# EAGLE design ECE411_T10_schematic (EAGLE 7.1.0)
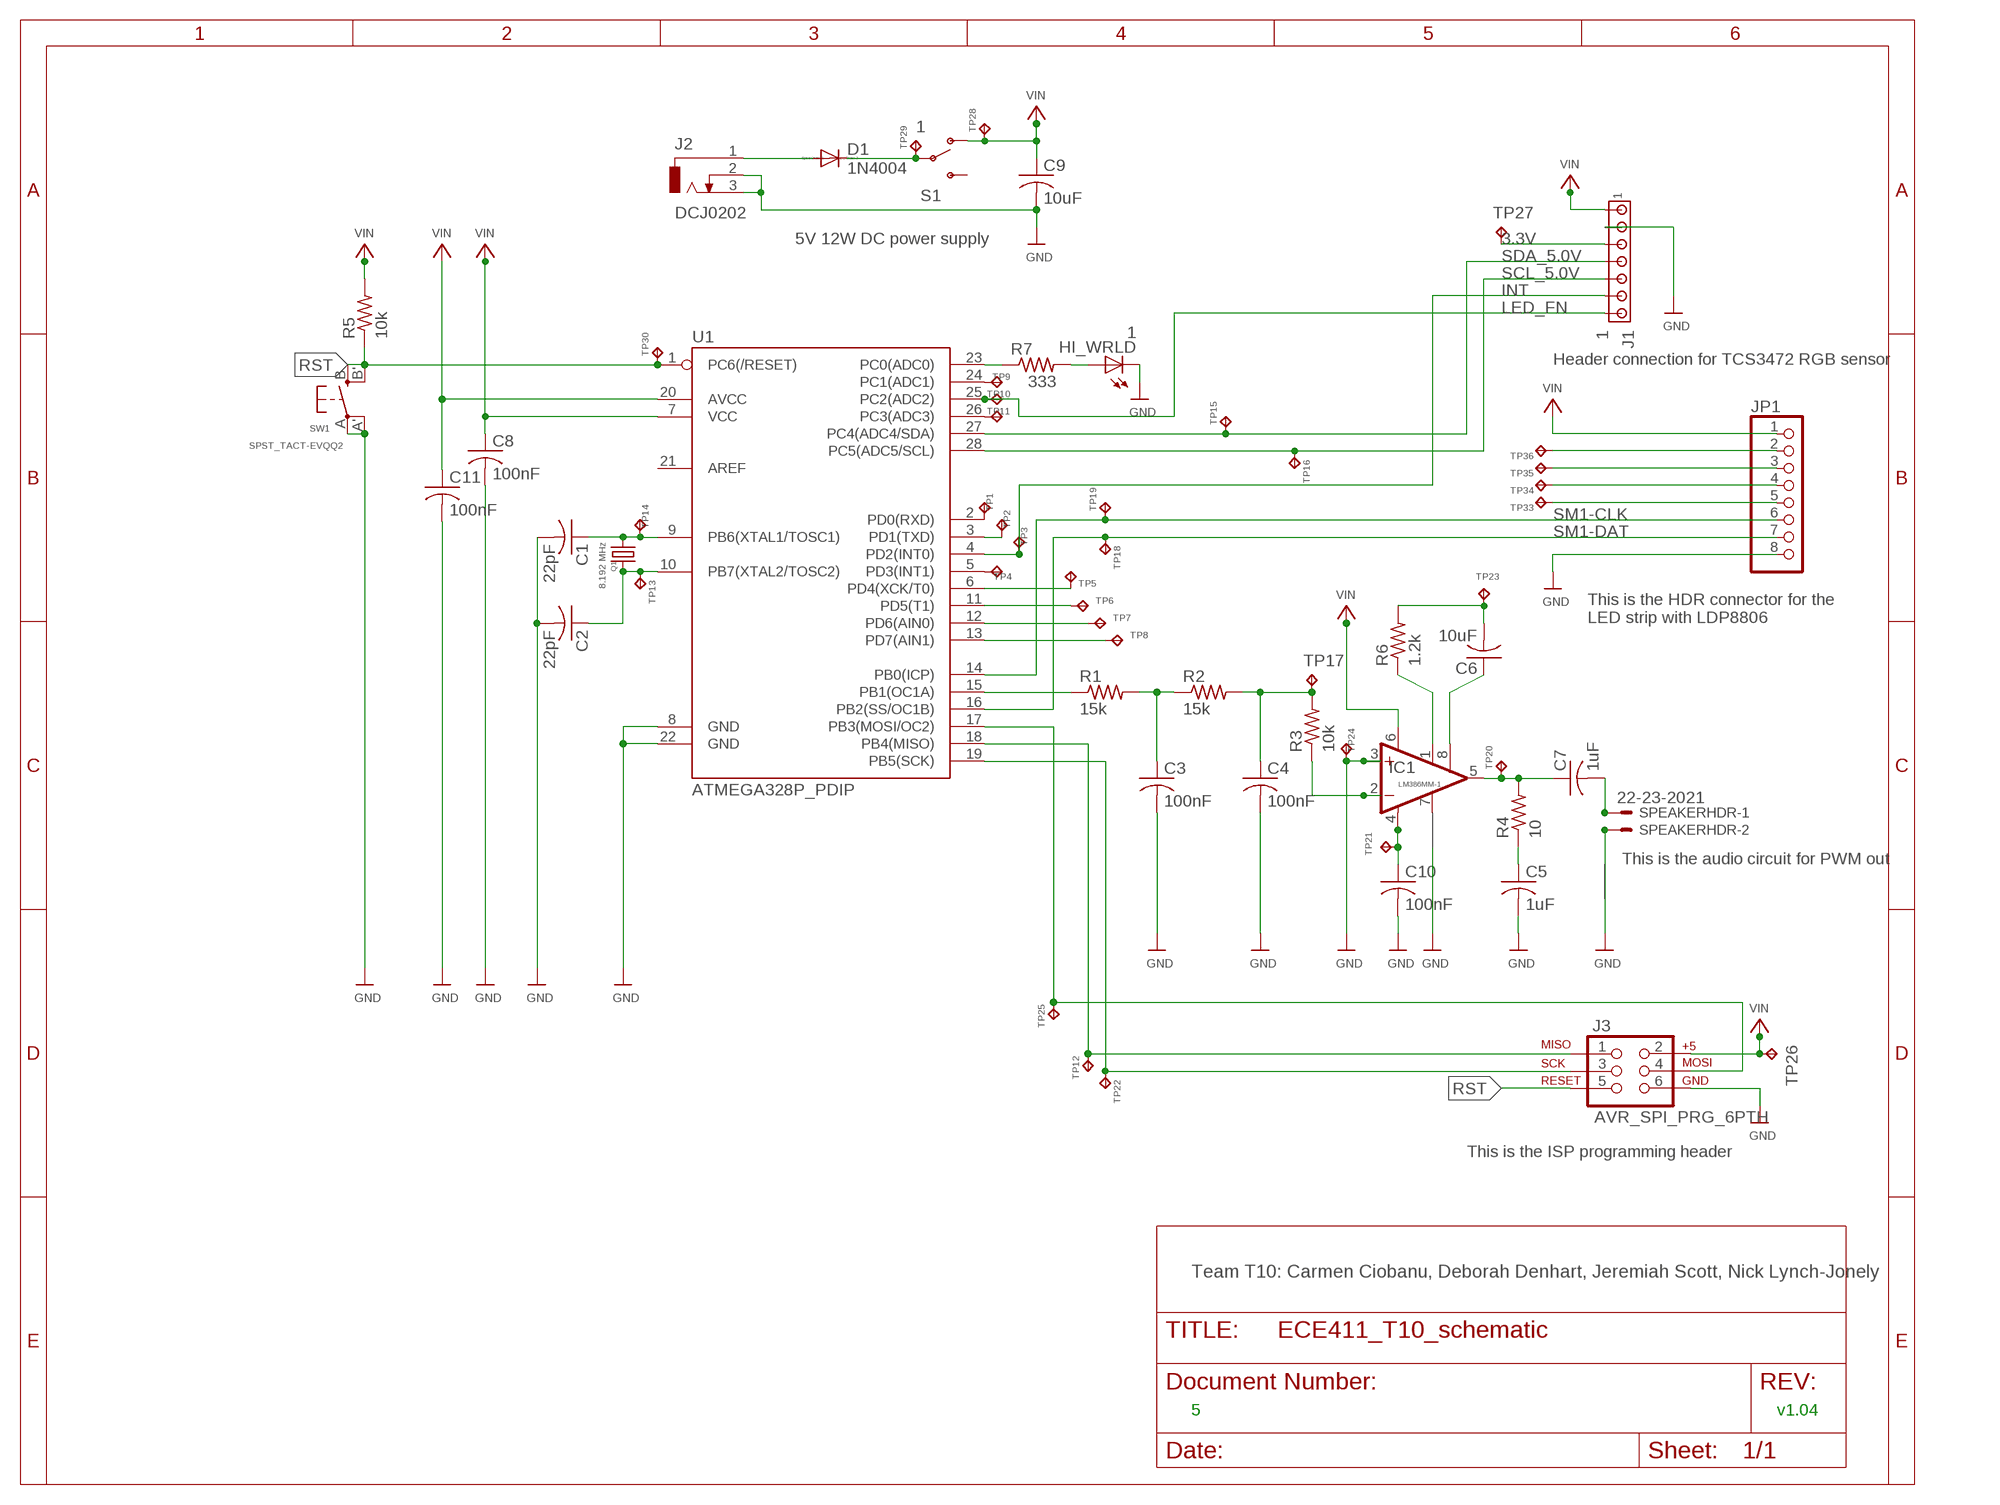
[diagram p0: schematic, sheet 1]

## Parts
C1  22pF  C-USC0805  [C0805]
C2  22pF  C-USC0805  [C0805]
C3  100nF  C-USC0805  [C0805]
C4  100nF  C-USC0805  [C0805]
C5  1uF  C-USC0805  [C0805]
C6  10uF  C-USC0805  [C0805]
C7  1uF  C-USC0805  [C0805]
C8  100nF  C-USC0805  [C0805]
C9  10uF  C-USC0805  [C0805]
C10  100nF  C-USC0805  [C0805]
C11  100nF  C-USC0805  [C0805]
D1  1N4004  [DO41-10]
HI_WRLD  1  LEDSML1206  [SML1206]
IC1  LM386MM-1  [MMSOP08]
J1  1  MTA07-100  [10X07MTA]
J2  DCJ0202  [DCJ0202]
J3  AVR_SPI_PRG_6PTH  [2X3]
JP1  PINHD-1X8  [1X08]
Q1  8.192 MHz  CRYSTALHC49S  [HC49/S]
R1  15k  R-US_M0805  [M0805]
R2  15k  R-US_M0805  [M0805]
R3  10k  R-US_M0805  [M0805]
R4  10  R-US_M0805  [M0805]
R5  10k  R-US_M0805  [M0805]
R6  1.2k  R-US_M0805  [M0805]
R7  333  R-US_M0805  [M0805]
S1  1  SWITCH-SPDT-SMD-A  [SWITCH-SPST-SMD-A]
SPEAKERHDR  22-23-2021  [22-23-2021]
SW1  SPST_TACT-EVQQ2  [EVQ-Q2]
TP1  TPB1,27  [B1,27]
TP2  TPB1,27  [B1,27]
TP3  TPB1,27  [B1,27]
TP4  TPB1,27  [B1,27]
TP5  TPB1,27  [B1,27]
TP6  TPB1,27  [B1,27]
TP7  TPB1,27  [B1,27]
TP8  TPB1,27  [B1,27]
TP9  TPB1,27  [B1,27]
TP10  TPB1,27  [B1,27]
TP11  TPB1,27  [B1,27]
TP12  TPB1,27  [B1,27]
TP13  TPB1,27  [B1,27]
TP14  TPB1,27  [B1,27]
TP15  TPB1,27  [B1,27]
TP16  TPB1,27  [B1,27]
TP17  TPB1,27  [B1,27]
TP18  TPB1,27  [B1,27]
TP19  TPB1,27  [B1,27]
TP20  TPB1,27  [B1,27]
TP21  TPB1,27  [B1,27]
TP22  TPB1,27  [B1,27]
TP23  TPB1,27  [B1,27]
TP24  TPB1,27  [B1,27]
TP25  TPB1,27  [B1,27]
TP26  TPB1,27  [B1,27]
TP27  TPB1,27  [B1,27]
TP28  TPB1,27  [B1,27]
TP29  TPB1,27  [B1,27]
TP30  TPB1,27  [B1,27]
TP33  TPB1,27  [B1,27]
TP34  TPB1,27  [B1,27]
TP35  TPB1,27  [B1,27]
TP36  TPB1,27  [B1,27]
U1  ATMEGA328P_PDIP  [DIL28-3]

## Nets
3.3V: J1.3 TP27.TP
GND: C1.2 C2.2 C3.2 C4.2 C5.2 C8.2 C9.2 C10.2 C11.2 HI_WRLD.C IC1.3(+IN) IC1.7(BYPASS) J1.2 J2.2 J2.3 J3.6 JP1.8 SPEAKERHDR.2 SW1.A'(P1) SW1.A(P) TP24.TP U1.8(GND) U1.22(GND)
INT: J1.6 TP3.TP U1.4(PD2(INT0))
LED_FN: J1.7 TP10.TP U1.25(PC2(ADC2))
N$1: C2.1 Q1.1 TP13.TP U1.10(PB7(XTAL2/TOSC2))
N$2: C1.1 Q1.2 TP14.TP U1.9(PB6(XTAL1/TOSC1))
N$3: IC1.1(GAIN) R6.1
N$4: R1.1 U1.15(PB1(OC1A))
N$5: C3.1 R1.2 R2.1
N$6: C4.1 R2.2 R3.2 TP17.TP
N$7: C6.1 IC1.8(GAIN)
N$8: IC1.2(-IN) R3.1
N$9: C5.1 R4.1
N$10: R7.1 U1.23(PC0(ADC0))
N$11: C6.2 R6.2 TP23.TP
N$12: C7.1 IC1.5(OUT) R4.2 TP20.TP
N$13: D1.A J2.1
N$14: C7.2 SPEAKERHDR.1
N$15: D1.C S1.2(P) TP29.TP
N$16: TP1.TP U1.2(PD0(RXD))
N$17: HI_WRLD.A R7.2
N$18: J3.3 TP22.TP U1.19(PB5(SCK))
N$19: J3.1 TP12.TP U1.18(PB4(MISO))
N$20: J3.4 TP25.TP U1.17(PB3(MOSI/OC2))
N$21: TP5.TP U1.6(PD4(XCK/T0))
N$22: TP2.TP U1.3(PD1(TXD))
N$24: TP4.TP U1.5(PD3(INT1))
N$25: TP6.TP U1.11(PD5(T1))
N$26: TP7.TP U1.12(PD6(AIN0))
N$27: TP8.TP U1.13(PD7(AIN1))
N$28: TP9.TP U1.24(PC1(ADC1))
N$30: TP11.TP U1.26(PC3(ADC3))
N$31: C10.1 IC1.4(GND) TP21.TP
N$33: JP1.2 TP36.TP
N$34: JP1.3 TP35.TP
N$35: JP1.4 TP34.TP
N$36: JP1.5 TP33.TP
RST: J3.5 R5.1 SW1.B'(S1) SW1.B(S) TP30.TP U1.1(PC6(/RESET))
SCL_5.0V: J1.5 TP16.TP U1.28(PC5(ADC5/SCL))
SDA_5.0V: J1.4 TP15.TP U1.27(PC4(ADC4/SDA))
SM1-CLK: JP1.6 TP19.TP U1.14(PB0(ICP))
SM1-DAT: JP1.7 TP18.TP U1.16(PB2(SS/OC1B))
VIN: C8.1 C9.1 C11.1 IC1.6(VS) J1.1 J3.2 JP1.1 R5.2 S1.1(O) TP26.TP TP28.TP U1.7(VCC) U1.20(AVCC)
Unconnected: S1.3(S) U1.21(AREF)

## Notes on the sheet
- 5V 12W DC power supply
- Header connection for TCS3472 RGB sensor
- This is the HDR connector for the 
  LED strip with LDP8806
- This is the audio circuit for PWM out
- This is the ISP programming header
- Team T10: Carmen Ciobanu, Deborah Denhart, Jeremiah Scott, Nick Lynch-Jonely
- 5 | v1.04

## Library data of the parts
C1-C10 = resistor:C-US: CAPACITOR, American symbol
C11 = adafruit:C-US: CAPACITOR, American symbol
D1 = diode:1N4004: DIODE general purpose rectifier, 1 A
HI_WRLD = led:LED: LED OSRAM: - CHIPLED LG R971, LG N971, LY N971, LG Q971, LY Q971, LO R971, LY R971 LH N974, LH R974 LS Q976, LO Q976, LY Q976 LO Q996 - Hyper CHIPLED LW Q18S LB Q993, LB Q99A, LB R99A - SideLED LS A670, LO A670, LY A670, LG A670, LP A670 LB A673, LV A673, LT A673, LW A673 LH A674 LY A675 LS A676, LA A676, LO A676, LY A676, LW A676 LS A679, LY A679, LG A679 - Hyper Micro SIDELED® LS Y876, LA Y876, LO Y876, LY Y876 LT Y87S - SmartLED LW L88C, LW L88S LB L89C, LB L89S, LG L890 LS L89K, LO L89K, LY L89K LS L896, LA L896, LO L896, LY L896 - TOPLED LS T670, LO T670, LY T670, LG T670, LP T670 LSG T670, LSP T670, LSY T670, LOP T670, LYG T670 LG T671, LOG T671, LSG T671 LB T673, LV T673, LT T673, LW T673 LH T674 LS T676, LA T676, LO T676, LY T676, LB T676, LH T676, LSB T676, LW T676 LB T67C, LV T67C, LT T67C, LS T67K, LO T67K, LY T67K, LW E67C LS E67B, LA E67B, LO E67B, LY E67B, LB E67C, LV E67C, LT E67C LW T67C LS T679, LY T679, LG T679 LS T770, LO T770, LY T770, LG T770, LP T770 LB T773, LV T773, LT T773, LW T773 LH T774 LS E675, LA E675, LY E675, LS T675 LS T776, LA T776, LO T776, LY T776, LB T776 LHGB T686 LT T68C, LB T68C - Hyper Mini TOPLED® LB M676 - Mini TOPLED Santana® LG M470 LS M47K, LO M47K, LY M47K Source: http://www.osram.convergy.de LUXEON: - LUMILED® LXK2-PW12-R00, LXK2-PW12-S00, LXK2-PW14-U00, LXK2-PW14-V00 LXK2-PM12-R00, LXK2-PM12-S00, LXK2-PM14-U00 LXK2-PE12-Q00, LXK2-PE12-R00, LXK2-PE12-S00, LXK2-PE14-T00, LXK2-PE14-U00 LXK2-PB12-K00, LXK2-PB12-L00, LXK2-PB12-M00, LXK2-PB14-N00, LXK2-PB14-P00, LXK2-PB14-Q00 LXK2-PR12-L00, LXK2-PR12-M00, LXK2-PR14-Q00, LXK2-PR14-R00 LXK2-PD12-Q00, LXK2-PD12-R00, LXK2-PD12-S00 LXK2-PH12-R00, LXK2-PH12-S00 LXK2-PL12-P00, LXK2-PL12-Q00, LXK2-PL12-R00 Source: www.luxeon.com KINGBRIGHT: KA-3528ASYC Source: www.kingbright.com
IC1 = linear:LM386?-*: Low Voltage Audio Power Amplifier Source: http://cache.national.com/ds/LM/LM386.pdf
J1 = con-amp:MTA07-100: AMP connector
J2 = con-jack:DCJ0202: DC POWER JACK Source: DCJ0202.pdf; OC_FARNELL: unknown; OC_NEWARK: unknown
J3 = SparkFun-Connectors:AVR_SPI_PRG_6: AVR ISP 6 Pin This is the reduced ISP connector for AVR programming. Common on Arduino. This footprint will take up less PCB space and can be used with a 10-pin to 6-pin adapter such as SKU: BOB-08508 **Special note about "TEST_POINT" package. The stop mask is on the top side, so if you want your programming test points to be on the bottom of your board, make sure to place this package on the bottom side of the board. This also ensure that the orientation to program from the bottom side will be correct.
JP1 = pinhead:PINHD-1X8: PIN HEADER
Q1 = adafruit:CRYSTAL: CRYSTAL; OC_FARNELL: 1667008; OC_NEWARK: unknown
R1-R7 = resistor:R-US_: RESISTOR, American symbol
S1 = SparkFun-Electromechanical:SWITCH-SPDT: SPDT Switch Simple slide switch, Spark Fun Electronics SKU : COM-00102 DPDT SMT slide switch, AYZ0202, SWCH-08179
SPEAKERHDR = con-molex:22-23-2021: .100" (2.54mm) Center Header - 2 Pin; MF: MOLEX; MPN: 22-23-2021; OC_FARNELL: 1462926; OC_NEWARK: 25C3832
SW1 = adafruit:SPST_TACT: SMT 6mm switch, EVQQ2 series http://www.ladyada.net/library/eagle
TP1-TP30 TP33-TP36 = testpad:TP: Test pad
U1 = SparkFun-DigitalIC:ATMEGA328P_PDIP: uC used in the Arduino 32kb flash, 1k EEPROM, 2k SRAM This is the through-hole version of this chip.

## Board
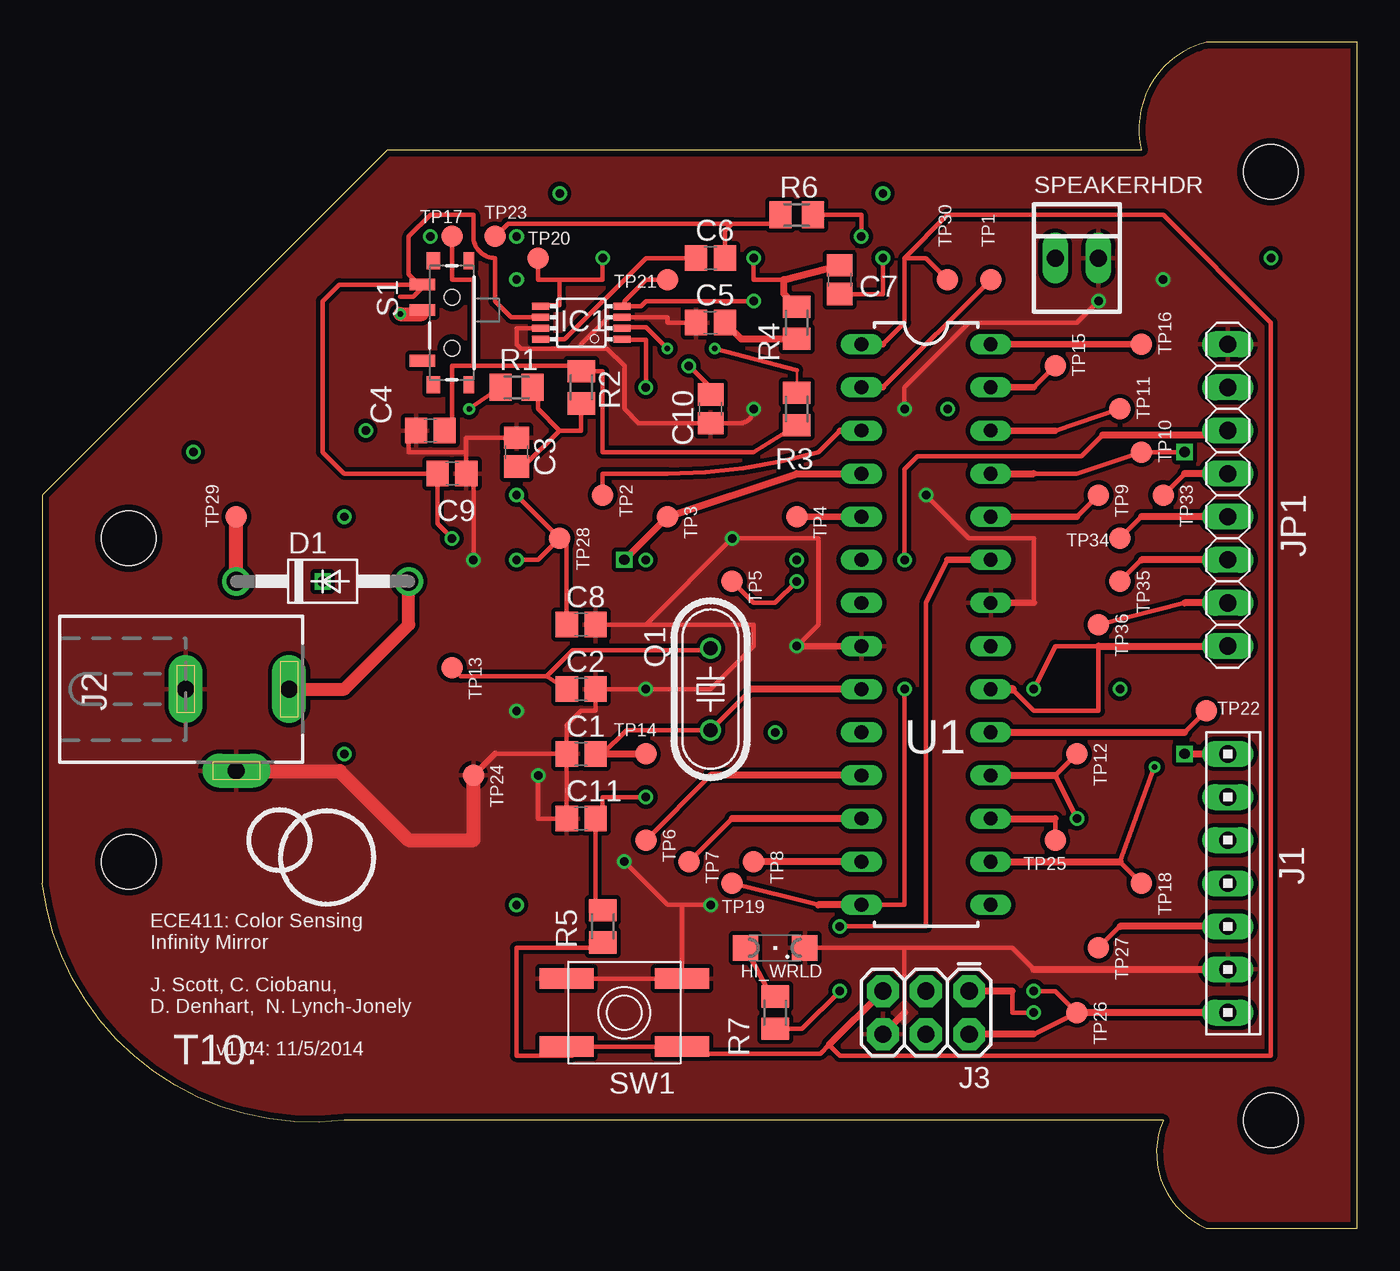
[diagram p1: board, top side]
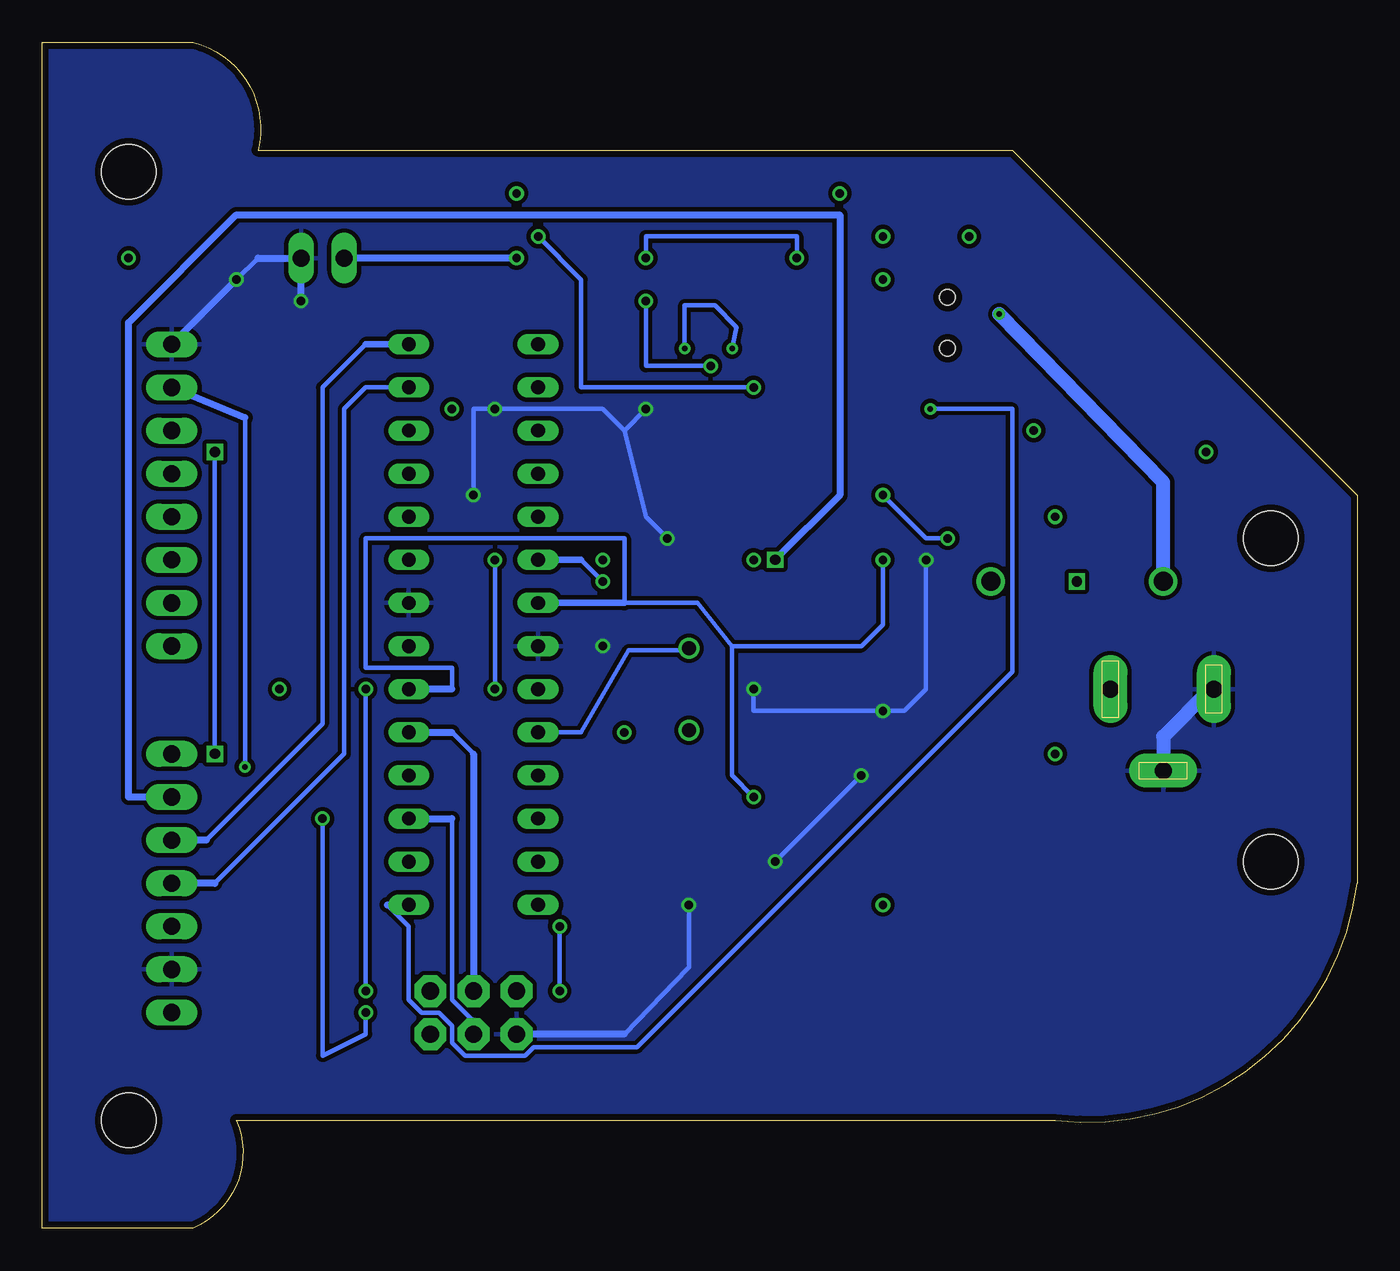
[diagram p2: board, bottom side, seen from below]

Size 77.47 x 69.85 mm. Coordinates in mm from the lower left corner, seen from the top.
Outline: 77.47,0 77.47,69.85 68.58,69.85 arc90 64.77,63.5 20.32,63.5 0,43.18 0,20.32 arc90 17.78,6.35 66.04,6.35 arc90 68.58,0 77.47,0
Copper layers (1*16): Top 0.0356mm / dielectric 1.5011mm / Bottom 0.0356mm
Design rules "OSH-Park-2-layer": minimum track width 6mil, minimum drill 13mil, track to track 6mil, track to pad 6mil, pad to pad 6mil, via to via 6mil, smd to smd 6mil, copper to edge 15mil, drill to drill 6mil, minimum pad ring 7mil, minimum via ring 7mil, stop-mask expansion 3mil, vias tented up to drill 0mil, thermal gap 10mil
Holes 3.2 mm at 72.39,62.23 72.39,6.35 5.08,40.64 5.08,21.59

### Footprints (pad centres in the part's own frame; a part is rotated, then mirrored left to right if it is on the bottom)
C0805 = smd 1.3 x 1.5: 1 -0.85,0; 2 0.85,0
DO41-10 = drill 1.118: A 5.08,0; C -5.08,0
SML1206 = smd 1.5 x 1.5: A 1.75,0; C -1.75,0
MMSOP08 = smd 0.41 x 1.02: 1 -0.975,-2.4; 2 -0.325,-2.4; 3 0.325,-2.4; 4 0.975,-2.4; 5 0.975,2.4; 6 0.325,2.4; 7 -0.325,2.4; 8 -0.975,2.4
10X07MTA = drill 1.016 long: 1 7.62,0; 2 5.08,0; 3 2.54,0; 4 0,0; 5 -2.54,0; 6 -5.08,0; 7 -7.62,0
DCJ0202 = drill 1 pad 2 long: 1 0,3.1; 2 4.8,0; 3 0,-3
2X3 = drill 1.016 pad 1.88 octagon: 1 0,0; 2 0,2.54; 3 2.54,0; 4 2.54,2.54; 5 5.08,0; 6 5.08,2.54
1X08 = drill 1.016 long: 1 -8.89,0; 2 -6.35,0; 3 -3.81,0; 4 -1.27,0; 5 1.27,0; 6 3.81,0; 7 6.35,0; 8 8.89,0
HC49/S = drill 0.813: 1 -2.413,0; 2 2.413,0
M0805 = smd 1.3 x 1.6: 1 -0.95,0; 2 0.95,0
SWITCH-SPST-SMD-A = smd 0.7 x 1.5: 1 -2.25,-1.75; 2 -0.75,-1.75; 3 2.25,-1.75 | smd 1 x 0.6: GND1 -3.65,1; GND3 3.65,1 | smd 1 x 0.8: GND2 -3.65,-1.1; GND4 3.65,-1.1 | hole 0.9: -1.5,0; 1.5,0
22-23-2021 = drill 1 long: 1 -1.27,0; 2 1.27,0
EVQ-Q2 = smd 3.2 x 1.2: A -3.4,-2; A' 3.4,-2; B -3.4,2; B' 3.4,2
B1,27 = smd 1.27 x 1.27: TP 0,0
DIL28-3 = drill 0.813 long: 1 -16.51,-3.81; 2 -13.97,-3.81; 3 -11.43,-3.81; 4 -8.89,-3.81; 5 -6.35,-3.81; 6 -3.81,-3.81; 7 -1.27,-3.81; 8 1.27,-3.81; 9 3.81,-3.81; 10 6.35,-3.81; 11 8.89,-3.81; 12 11.43,-3.81; 13 13.97,-3.81; 14 16.51,-3.81; 15 16.51,3.81; 16 13.97,3.81; 17 11.43,3.81; 18 8.89,3.81; 19 6.35,3.81; 20 3.81,3.81; 21 1.27,3.81; 22 -1.27,3.81; 23 -3.81,3.81; 24 -6.35,3.81; 25 -8.89,3.81; 26 -11.43,3.81; 27 -13.97,3.81; 28 -16.51,3.81

### Placement (x,y rotation side)
C1  31.75,27.94 180 top
C2  31.75,31.75 0 top
C3  27.94,45.72 90 top
C4  22.86,46.99 180 top
C5  39.37,53.34 180 top
C6  39.37,57.15 0 top
C7  46.99,55.88 270 top
C8  31.75,35.56 0 top
C9  24.13,44.45 0 top
C10  39.37,48.26 270 top
C11  31.75,24.13 180 top
D1  16.51,38.1 0 top
HI_WRLD  43.18,16.51 180 top
IC1  31.75,53.34 90 top
J1  69.85,20.32 270 top
J2  11.43,31.75 270 top
J3  54.61,13.97 180 top
JP1  69.85,43.18 90 top
Q1  39.37,31.75 270 top
R1  27.94,49.53 0 top
R2  31.75,49.53 90 top
R3  44.45,48.26 270 top
R4  44.45,53.34 90 top
R5  33.02,17.78 90 top
R6  44.45,59.69 180 top
R7  43.18,12.7 90 top
S1  24.13,53.34 270 top
SPEAKERHDR  60.96,57.15 0 top
SW1  34.29,12.7 180 top
TP1  55.88,55.88 0 top
TP2  33.02,43.18 0 top
TP3  36.83,41.91 0 top
TP4  44.45,41.91 0 top
TP5  40.64,38.1 0 top
TP6  35.56,22.86 0 top
TP7  38.1,21.59 0 top
TP8  41.91,21.59 0 top
TP9  62.23,43.18 0 top
TP10  64.77,45.72 0 top
TP11  63.5,48.26 0 top
TP12  60.96,27.94 0 top
TP13  24.13,33.02 0 top
TP14  35.56,27.94 0 top
TP15  59.69,50.8 0 top
TP16  64.77,52.07 0 top
TP17  24.13,58.42 0 top
TP18  64.77,20.32 0 top
TP19  40.64,20.32 0 top
TP20  29.21,57.15 0 top
TP21  36.83,55.88 0 top
TP22  68.58,30.48 0 top
TP23  26.67,58.42 0 top
TP24  25.4,26.67 0 top
TP25  59.69,22.86 0 top
TP26  60.96,12.7 0 top
TP27  62.23,16.51 0 top
TP28  30.48,40.64 0 top
TP29  11.43,41.91 0 top
TP30  53.34,55.88 0 top
TP33  66.04,43.18 0 top
TP34  63.5,40.64 0 top
TP35  63.5,38.1 0 top
TP36  62.23,35.56 0 top
U1  52.07,35.56 270 top

### Tracks (layer width: path | path; a pad name or v marks a point on that pad's centre or on a via)
3.3V
  Top 0.254: 63.5,17.78 TP27.TP
  Top 0.406: J1.3 63.5,17.78
GND  (via drill 0.5)
  Top 0.152: 11.43,26.92 J2.2 | 25.65,26.92 TP24.TP | 34.04,53.59 IC1.3
  Top 0.254: C1.2 26.67,27.94 | 31.75,51.82 33.27,51.82 34.29,50.8 34.29,48.26 35.14,47.41 C10.2 41.06,47.41 arc90 v41.91,48.26 | 31.75,51.82 28.19,51.82 27.94,52.07 27.94,53.02 IC1.7 | 50.8,12.7 50.8,16.51 | 50.8,16.51 57.15,16.51 58.42,15.24 | HI_WRLD.C 50.8,16.51 | SW1.A' SW1.A 37.69,19.05 | 58.42,36.83 58.42,40.64 54.61,40.64 v52.07,43.18 | v44.45,34.29 45.72,35.56 45.72,40.64 v40.64,40.64 35.56,35.56 | 37.69,19.05 v39.37,19.05 | 31.75,51.82 31.75,52.07 33.34,53.67 IC1.3 36.83,53.67 36.83,53.34 C5.2 | C1.2 C11.2 29.21,24.13 v29.21,26.67 | C1.2 30.9,29.63 31.75,30.48 32.6,30.48 C2.2 v35.56,31.75 39.37,31.75 41.91,34.29 41.91,35.56 35.56,35.56 | C8.2 35.56,35.56 | 24.98,45.72 C9.2 25.4,44.45 v25.4,39.37 | 24.98,45.72 24.98,46.57 C3.2 | 24.98,45.72 21.59,45.72 21.59,46.99 C4.2 | 37.69,19.05 36.83,19.05 v34.29,21.59 | v50.8,48.26 50.8,49.53 54.61,53.34 60.96,53.34 v62.23,54.61
  Top 0.381: 26.67,27.94 25.65,26.92 | v44.45,34.29 U1.8 | U1.22 58.42,36.83
  Top 0.406: 58.42,15.24 J1.2 | J3.6 50.8,12.7
  Top 0.813: 11.43,26.92 17.53,26.92 21.59,22.86 25.4,22.86 TP24.TP
  Bottom 0.152: 8.64,31.75 J2.3
  Bottom 0.254: 43.18,11.43 39.44,15.3 39.37,15.37 v39.37,19.05 | v66.04,55.88 64.77,57.15 | v40.64,40.64 41.91,41.91 43.18,46.99 | 43.18,46.99 44.45,48.26 v50.8,48.26 52.07,48.26 v52.07,43.18 | v41.91,48.26 43.18,46.99 | v35.56,31.75 35.56,30.48 v27.94,30.48 26.67,30.48 25.4,31.75 v25.4,39.37 | v34.29,21.59 v29.21,26.67
  Bottom 0.406: 43.18,11.43 J3.6 | 64.77,57.15 SPEAKERHDR.2 v62.23,54.61 | JP1.8 v66.04,55.88
  Bottom 0.813: J2.2 11.43,28.96 8.64,31.75
  pour Top (isolate 0.254): 0,43.18 20.32,63.5 64.77,63.5 arc-90 68.58,69.85 77.47,69.85 77.47,0 68.58,0 arc-90 66.04,6.35 16.51,6.35 arc-90 0,20.32
  pour Bottom (isolate 0.254): 0,43.18 20.32,63.5 64.77,63.5 arc-90 68.58,69.85 77.47,69.85 77.47,0 68.58,0 arc-90 66.04,6.35 17.78,6.35 arc-90 0,20.32
INT  (via drill 0.6)
  Top 0.406: v34.29,39.37 TP3.TP 44.45,44.45 U1.4
  Bottom 0.406: J1.6 72.39,25.4 72.39,53.34 66.04,59.69 30.48,59.69 30.48,43.18 v34.29,39.37
LED_FN  (via drill 0.6)
  Top 0.254: 58.42,44.45 60.96,44.45 TP10.TP v67.31,45.72
  Top 0.406: U1.25 58.42,44.45 | v67.31,27.94 J1.7
  Bottom 0.254: v67.31,45.72 v67.31,27.94
N$1
  Top 0.152: 24.64,32.51 TP13.TP
  Top 0.254: 29.72,32.51 24.64,32.51 | C2.1 29.72,32.51 | 29.72,32.51 31.24,34.04 39.37,34.04 Q1.1
  Bottom 0.254: Q1.1 39.37,34.04 42.93,34.04 45.72,29.21 U1.10
N$2
  Top 0.254: 41.78,31.75 Q1.2 34.42,29.34 33.02,27.94
  Top 0.406: U1.9 41.78,31.75 | TP14.TP 33.02,27.94 C1.1
N$3  (via drill 0.5)
  Top 0.152: 34.29,52.32 IC1.1
  Top 0.254: 34.29,52.32 35.56,52.32 v35.56,49.53 | R6.1 48.26,59.69 v48.26,58.42
  Bottom 0.254: v35.56,49.53 45.72,49.53 45.72,55.88 v48.26,58.42
N$4  (via drill 0.33)
  Top 0.254: v25.15,48.26 R1.1
  Bottom 0.254: v25.15,48.26 20.32,48.26 20.32,32.77 42.42,10.67 48.51,10.67 49.02,10.16 52.58,10.16 53.34,10.92 53.34,11.94 54.1,12.7 55.12,12.7 55.88,13.46 55.88,17.78 57.15,19.05
  Bottom 0.406: 57.15,19.05 U1.15
N$5
  Top 0.152: 31.75,48.77 R2.1
  Top 0.254: 31.75,48.77 31.75,46.99 30.48,46.99 | 30.48,46.99 29.21,48.26 29.21,49.21 R1.2 | C3.1 28.36,44.87 30.48,46.99
N$6
  Top 0.152: 31.75,50.29 R2.2
  Top 0.254: 31.75,50.29 31.24,50.8 25.4,50.8 | 25.4,50.8 24.13,50.8 24.13,47.41 C4.1 | R3.2 41.91,45.72 33.02,45.72 33.02,50.48 R2.2 | TP17.TP 24.13,55.88 25.4,55.88 25.4,50.8
N$7
  Top 0.254: IC1.8 30.77,52.37 35.56,57.15 C6.1
N$8  (via drill 0.33)
  Top 0.152: 34.29,53.09 IC1.2 | 44.45,50.55 R3.1
  Top 0.254: 44.45,50.55 v39.62,51.82 | 34.29,53.09 35.56,53.09 v36.83,51.82
  Bottom 0.254: v36.83,51.82 36.58,53.09 37.85,54.36 39.62,54.36 v39.62,51.82
N$9
  Top 0.406: C5.1 41.17,52.39 R4.1
N$10  (via drill 0.5)
  Top 0.254: R7.1 44.77,11.75 v46.99,13.97 | v46.99,17.78 52.07,17.78 52.07,36.83 53.34,39.37
  Top 0.381: 53.34,39.37 U1.23
  Bottom 0.254: v46.99,13.97 v46.99,17.78
N$11
  Top 0.254: TP23.TP 27.43,59.18 40.64,59.18 | 40.64,59.18 40.22,58.76 C6.2 | 40.64,59.18 43.5,59.18
  Top 0.406: 43.5,59.18 R6.2
N$12  (via drill 0.5)
  Top 0.152: 29.21,54.36 IC1.5
  Top 0.254: 29.21,54.36 30.48,54.36 30.48,55.88 | 30.48,55.88 29.21,55.88 TP20.TP | 43.69,55.88 41.91,55.88 v41.91,57.15 | v33.02,57.15 33.02,55.88 30.48,55.88
  Top 0.406: R4.2 43.69,55.05 43.69,55.88 C7.1
  Bottom 0.254: v33.02,57.15 33.02,58.42 41.91,58.42 v41.91,57.15
N$13
  Top 0.762: J2.1 17.78,31.75 21.59,35.56 D1.A
N$14  (via drill 0.5)
  Top 0.254: v49.53,57.15 49.53,55.03 C7.2
  Bottom 0.406: v49.53,57.15 SPEAKERHDR.1
N$15  (via drill 0.33)
  Top 0.152: 22.35,53.85 S1.2
  Top 0.813: D1.C TP29.TP | v21.08,53.85 22.35,53.85
  Bottom 0.813: v21.08,53.85 11.43,43.94 11.43,38.61 D1.C
N$16
  Top 0.254: 49.53,49.53 TP1.TP
  Top 0.381: U1.2 49.53,49.53
N$17
  Top 0.254: HI_WRLD.A 42.7,14.13 R7.2
N$18
  Top 0.254: 67.31,29.21 TP22.TP
  Top 0.406: U1.19 67.31,29.21
  Bottom 0.254: 53.34,29.21 52.07,27.94
  Bottom 0.406: U1.19 53.34,29.21 | 52.07,27.94 J3.3
N$19  (via drill 0.5)
  Top 0.254: TP12.TP 59.69,26.67 v60.96,24.13 | v58.42,12.7 57.15,12.7 57.15,13.97
  Top 0.406: U1.18 59.69,26.67 | 57.15,13.97 J3.1
  Bottom 0.254: v60.96,24.13 60.96,10.16 58.42,11.43 v58.42,12.7
N$20
  Top 0.254: 59.69,24.13 TP25.TP
  Top 0.406: U1.17 59.69,24.13
  Bottom 0.254: 52.07,12.19 53.34,13.46 53.34,24.13
  Bottom 0.406: 52.07,12.19 J3.4 | U1.17 53.34,24.13
N$21  (via drill 0.5)
  Top 0.254: v44.45,38.1 43.18,36.83 41.91,36.83 TP5.TP
  Bottom 0.254: 45.72,39.37 v44.45,38.1
  Bottom 0.381: U1.6 45.72,39.37
N$22
  Top 0.254: 46.99,46.99 45.72,45.72 arc-16 36.83,44.45 33.02,44.45 TP2.TP
  Top 0.381: U1.3 46.99,46.99
N$24
  Top 0.381: U1.5 TP4.TP
N$25
  Top 0.254: 39.37,26.67 TP6.TP
  Top 0.406: U1.11 39.37,26.67
N$26
  Top 0.254: 40.64,24.13 TP7.TP
  Top 0.406: U1.12 40.64,24.13
N$27
  Top 0.406: U1.13 TP8.TP
N$28
  Top 0.254: 60.96,41.91 TP9.TP
  Top 0.381: U1.24 60.96,41.91
N$30
  Top 0.254: 59.69,46.99 TP11.TP
  Top 0.381: U1.26 59.69,46.99
N$31  (via drill 0.5)
  Top 0.254: C10.1 39.37,49.53 v38.1,50.8 | v41.91,54.61 35.56,54.61 35.27,54.32 IC1.4 34.29,54.46 34.29,54.61 35.56,55.88 TP21.TP
  Bottom 0.254: v38.1,50.8 41.91,50.8 v41.91,54.61
N$32  (via drill 0.5)
  other vias: 17.78,27.94
N$33
  Top 0.254: 67.31,36.83 TP36.TP
  Top 0.406: JP1.2 67.31,36.83
N$34
  Top 0.254: 64.77,39.37 TP35.TP
  Top 0.406: JP1.3 64.77,39.37
N$35
  Top 0.254: 64.77,41.91 TP34.TP
  Top 0.406: JP1.4 64.77,41.91
N$36
  Top 0.254: 67.31,44.45 TP33.TP
  Top 0.406: JP1.5 67.31,44.45
N$37  (via drill 0.5)
  other vias: 19.05,46.99
N$38  (via drill 0.5)
  other vias: 17.78,41.91
N$39  (via drill 0.5)
  other vias: 8.89,45.72
N$40  (via drill 0.5)
  other vias: 27.94,55.88
N$41  (via drill 0.5)
  other vias: 22.86,58.42
N$42  (via drill 0.5)
  other vias: 30.48,60.96
N$43  (via drill 0.6)
  other vias: 16.51,38.1
N$44  (via drill 0.5)
  other vias: 49.53,60.96
N$45  (via drill 0.5)
  other vias: 27.94,19.05
N$46  (via drill 0.5)
  other vias: 44.45,39.37
N$47  (via drill 0.5)
  other vias: 35.56,39.37
N$48  (via drill 0.5)
  other vias: 72.39,57.15
N$49  (via drill 0.5)
  other vias: 53.34,48.26
N$50  (via drill 0.5)
  other vias: 27.94,58.42
N$51  (via drill 0.5)
  other vias: 63.5,31.75
N$52  (via drill 0.5)
  other vias: 43.18,29.21
RST
  Top 0.254: SW1.B' 31.75,10.7 | 31.75,10.7 SW1.B 38.1,10.29 45.85,10.29 46.35,10.79 46.99,10.16 72.39,10.16 72.39,53.34 66.04,59.69 53.34,59.69 50.8,57.15 | R5.1 32.7,16.51 27.94,16.51 27.94,10.16 31.21,10.16 31.75,10.7 | 49.53,52.07 50.8,53.34 50.8,57.15 | TP30.TP 52.07,57.15 50.8,57.15
  Top 0.381: U1.1 49.53,52.07
  Top 0.406: 46.35,10.79 J3.5
  Bottom 0.635: J3.5 49.78,14.22
SCL_5.0V
  Top 0.381: U1.28 TP16.TP
  Bottom 0.254: 67.82,22.86 60.96,29.72 60.96,49.53 58.42,52.07
  Bottom 0.381: U1.28 58.42,52.07
  Bottom 0.406: 67.82,22.86 J1.5
SDA_5.0V
  Top 0.254: 58.42,49.53 TP15.TP
  Top 0.381: U1.27 58.42,49.53
  Bottom 0.254: 67.31,20.32 59.69,27.94 59.69,48.26 58.42,49.53 U1.27
  Bottom 0.406: 67.31,20.32 J1.4
SM1-CLK  (via drill 0.5)
  Top 0.254: 45.72,19.05 TP19.TP | 62.48,46.74 61.21,45.47 51.56,45.47 50.8,44.7 v50.8,39.37 | v50.8,31.75 50.8,19.05 U1.14
  Top 0.406: U1.14 45.72,19.05 | JP1.6 69.6,46.74 62.48,46.74
  Bottom 0.254: v50.8,39.37 v50.8,31.75
SM1-DAT  (via drill 0.33)
  Top 0.254: TP18.TP 63.5,21.59 v65.53,27.18
  Top 0.406: U1.16 63.5,21.59
  Bottom 0.254: v65.53,27.18 65.53,47.75
  Bottom 0.406: 65.53,47.75 JP1.7
VIN  (via drill 0.5)
  Top 0.152: 22.35,55.37 S1.1
  Top 0.254: 21.08,54.86 21.84,54.86 22.38,55.4 | 22.38,55.4 S1.1 17.49,55.59 16.51,54.61 16.51,45.72 17.78,44.45 C9.1 23.28,41.49 v24.13,40.64 | 22.38,55.4 21.59,56.19 21.59,58.42 22.86,59.69 25.4,59.69 25.4,58.42 arc90 26.67,57.15 26.67,54.61 27.61,53.67 IC1.6 | 58.42,11.43 TP26.TP 59.69,13.97 v58.42,13.97 | R5.2 32.6,19.15 C11.1 33.02,24.55 33.02,25.4 v35.56,25.4 | 57.15,31.75 58.42,30.48 62.23,30.48 62.23,34.29 59.69,34.29 v58.42,31.75 | TP28.TP v27.94,43.18 | v27.94,39.37 29.21,39.37 TP28.TP | C8.1 30.9,40.22 TP28.TP
  Top 0.406: J1.1 TP26.TP | 58.42,11.43 J3.2 | 62.23,34.29 JP1.1
  Top 0.508: 57.15,31.75 U1.20
  Bottom 0.254: 36.83,34.29 36.83,26.67 v35.56,25.4 | 36.83,34.29 38.86,36.83 43.18,36.83 43.18,40.64 58.42,40.64 58.42,33.02 53.34,33.02 53.34,31.75 | 36.83,34.29 29.21,34.29 27.94,35.56 v27.94,39.37 | v58.42,13.97 v58.42,31.75 | v27.94,43.18 25.4,40.64 v24.13,40.64
  Bottom 0.381: 43.18,36.83 U1.7
  Bottom 0.406: 53.34,31.75 U1.20

### Text on the board
tPlace: T10: | ECE411: Color Sensing / Infinity Mirror / / J. Scott, C. Ciobanu, / D. Denhart, N. Lynch-Jonely / / v1.04: 11/5/2014
tSilk: T10: